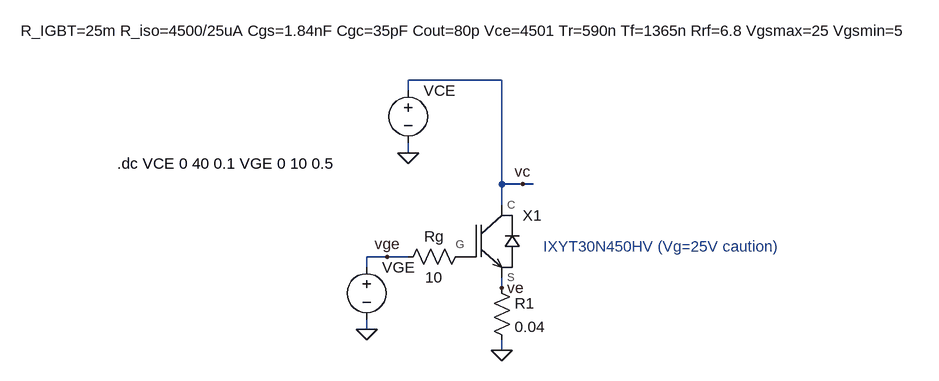
[diagram p0: schematic IXYT_IGBT_Output_characteristic_analysis.asc]
IXYT_IGBT_Output_characteristic_analysis.asc, the LTspice schematic file:
Version 4
SHEET 1 2256 680
WIRE 672 -112 528 -112
WIRE 528 -96 528 -112
WIRE 528 0 528 -16
WIRE 672 48 672 -112
WIRE 704 48 672 48
WIRE 720 48 704 48
WIRE 672 80 672 48
WIRE 496 160 464 160
WIRE 528 160 496 160
WIRE 464 176 464 160
WIRE 672 208 672 192
WIRE 464 272 464 256
WIRE 672 304 672 288
FLAG 528 0 0
FLAG 672 304 0
FLAG 464 272 0
FLAG 496 160 vge
FLAG 704 48 vc
FLAG 672 208 ve
SYMBOL voltage 464 160 R0
WINDOW 123 0 0 Left 0
WINDOW 39 0 0 Left 0
SYMATTR InstName VGE
SYMATTR Value ""
SYMBOL voltage 528 -112 R0
WINDOW 3 22 98 Left 2
WINDOW 123 0 0 Left 0
WINDOW 39 0 0 Left 0
SYMATTR Value ""
SYMATTR InstName VCE
SYMBOL IGBT_model 640 176 R0
WINDOW 39 -708 -364 Left 2
SYMATTR SpiceLine R_IGBT=25m R_iso=4500/25uA Cgs=1.84nF Cgc=35pF Cout=80p Vce=4501 Tr=590n Tf=1365n Rrf=6.8 Vgsmax=25 Vgsmin=5
SYMATTR InstName X1
SYMBOL res 624 144 R90
WINDOW 0 0 56 VBottom 2
WINDOW 3 32 56 VTop 2
SYMATTR InstName Rg
SYMATTR Value 10
SYMBOL res 656 192 R0
SYMATTR InstName R1
SYMATTR Value 0.04
TEXT 736 144 Left 2 ;IXYT30N450HV (Vg=25V caution)
TEXT 80 16 Left 2 !.dc VCE 0 40 0.1 VGE 0 10 0.5

The netlist it stands for:
* IXYT_IGBT_Output_characteristic_analysis.asc
VGE vge 0
VCE vc 0
XX1 vc P001 ve IGBT_model params: R_IGBT=25m R_iso=4500/25uA Cgs=1.84nF Cgc=35pF Cout=80p Vce=4501 Tr=590n Tf=1365n Rrf=6.8 Vgsmax=25 Vgsmin=5  ; pins C G S
Rg P001 vge 10
R1 ve 0 0.04
* IXYT30N450HV (Vg=25V caution)
.dc VCE 0 40 0.1 VGE 0 10 0.5
.backanno
.end